# EasyEDA Pro project esp32_sd.eprj

# Schematic Schematic1
Board Name: Board1; Create Date: 2025-02-09; Page Name: P1; Project Name: esp32_sd; Schematic Name: Schematic1; Update Date: 2025-02-19; Company: 嘉立创EDA; Page Size: A4; Version: V1.0
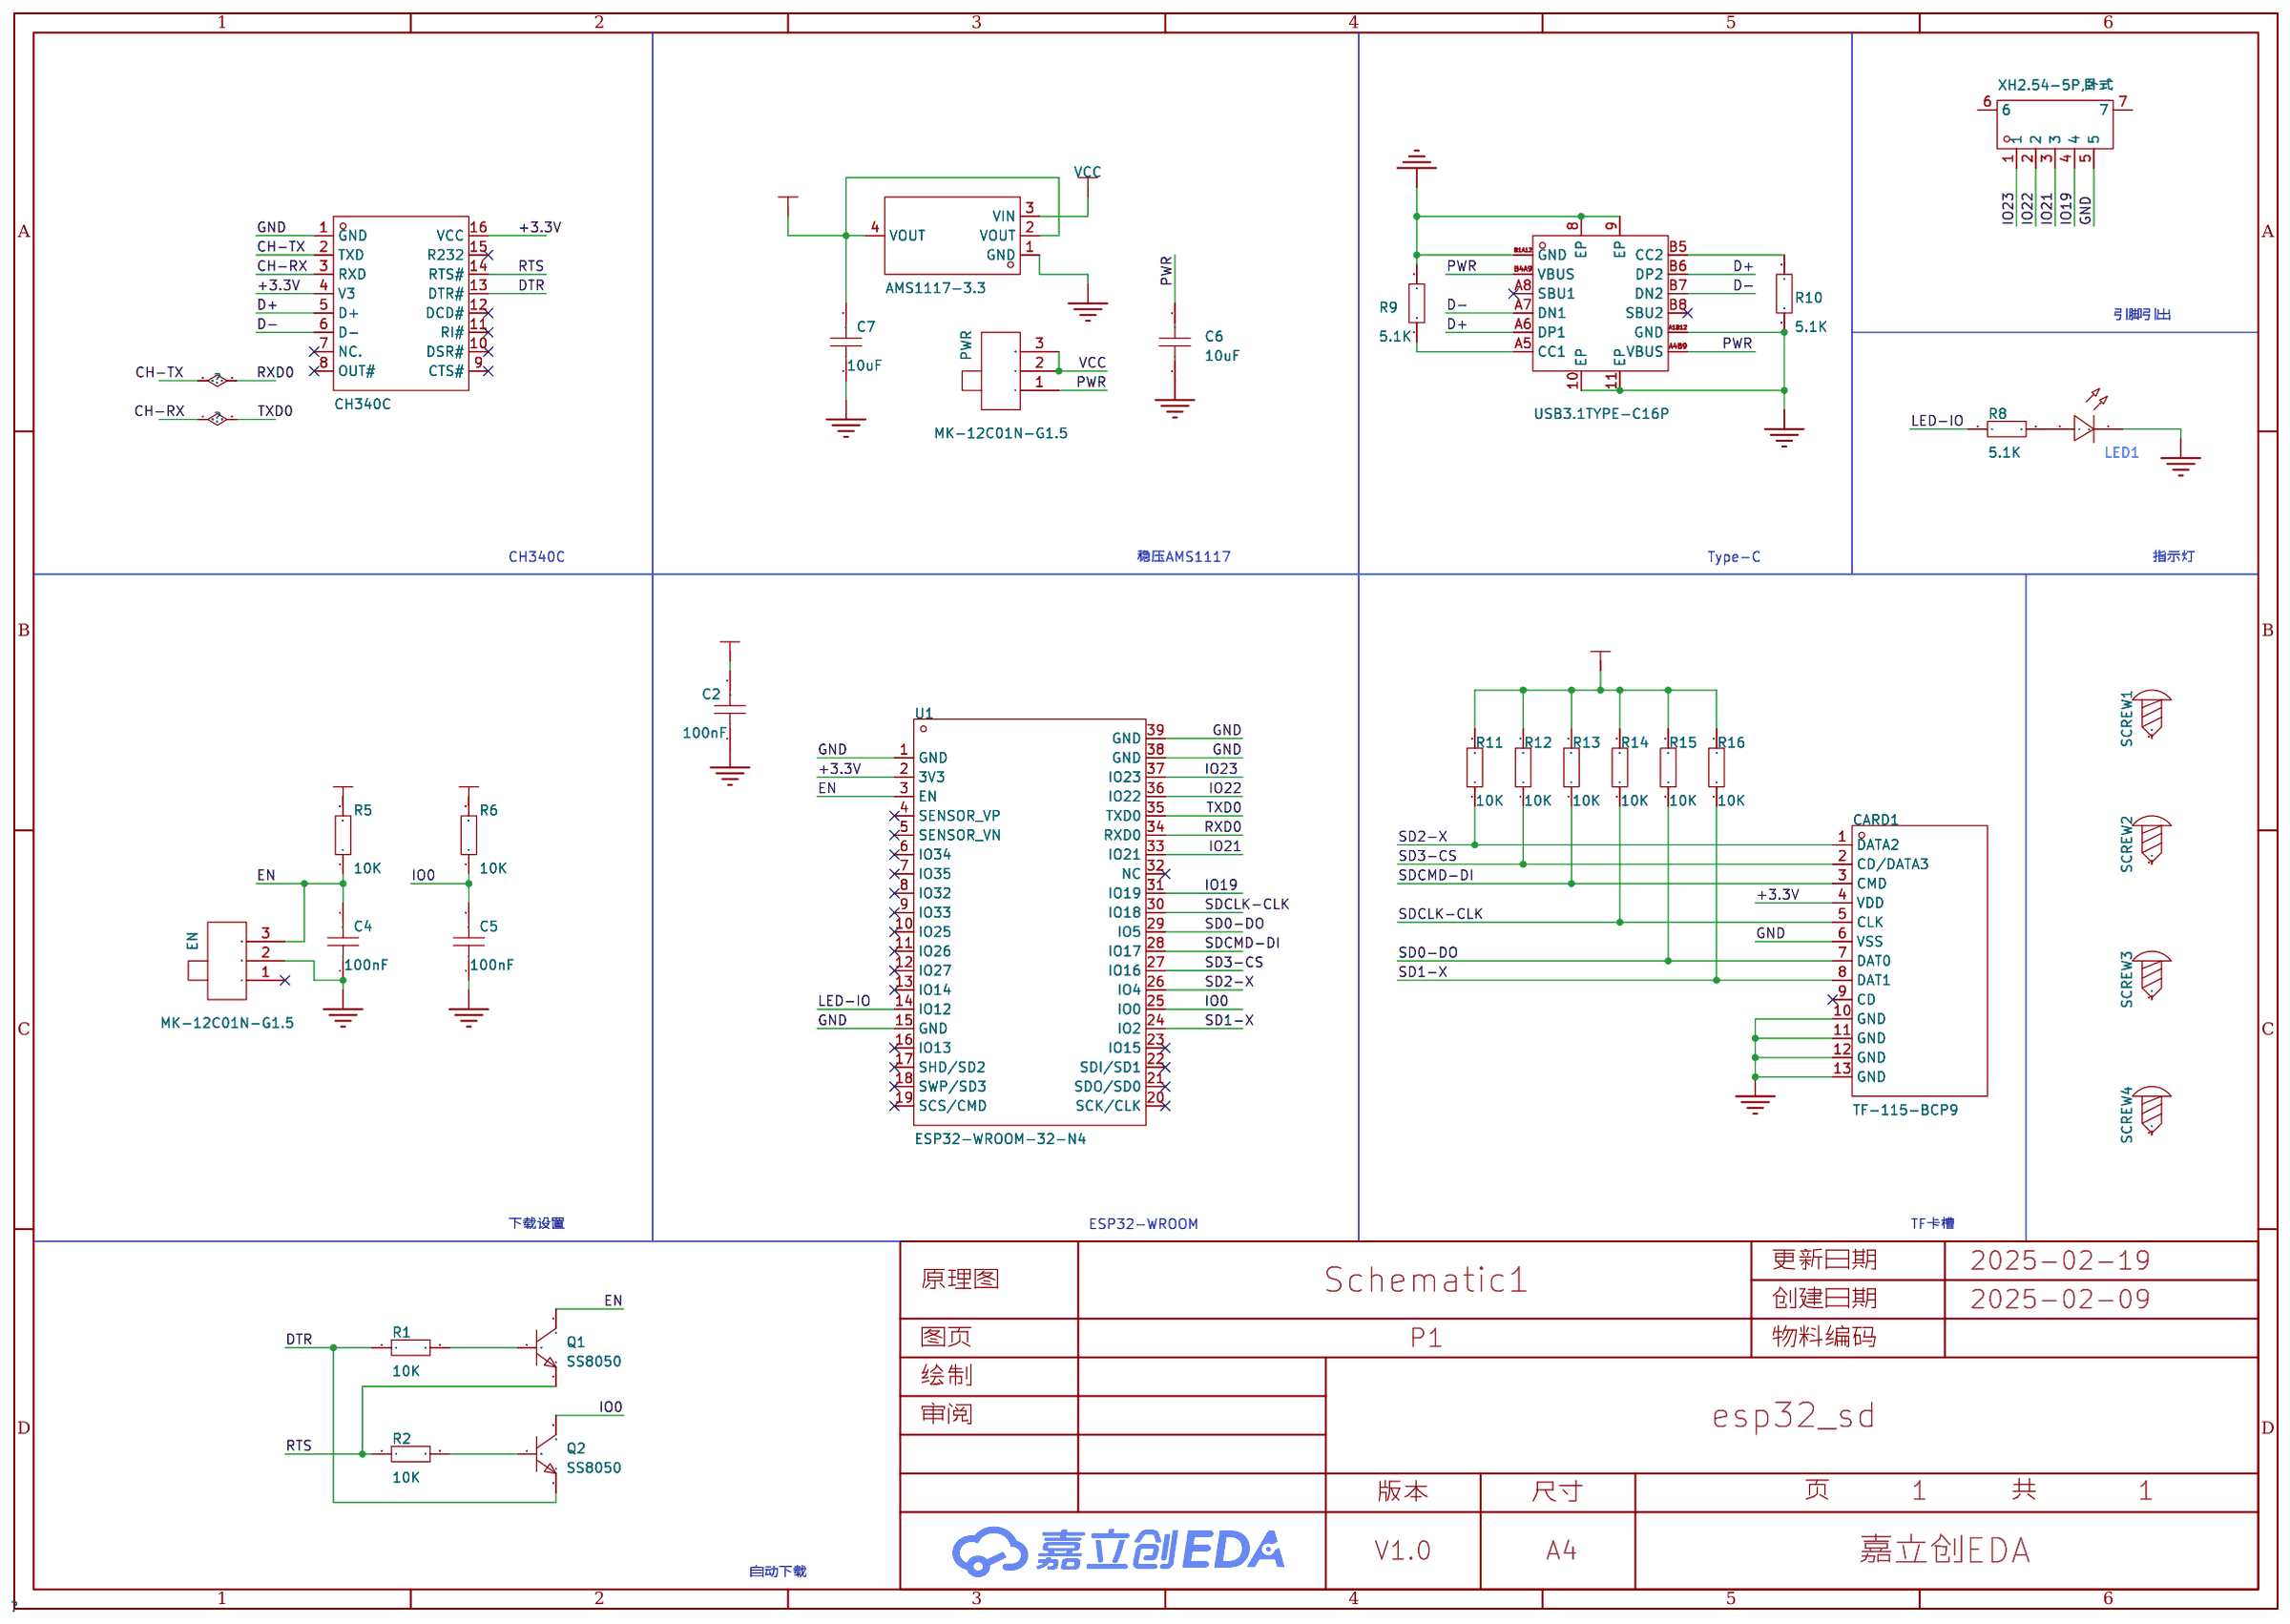
[diagram p0: schematic sheet]

## Parts
C2  100nF  [C0805]
C4  100nF  [C0805]
C5  100nF  [C0805]
C6  10uF  [C0805]
C7  10uF  [C0805]
CARD1  TF-115-BCP9  [TF-SMD_TF-115-BCP9]
EN  MK-12C01N-G1.5  [SW-SMD_DEALON_MK-12C01N-G1.5]
LED1  -  [LED_0805]
PWR  MK-12C01N-G1.5  [SW-SMD_DEALON_MK-12C01N-G1.5]
Q1  SS8050  [SOT-23-3_L2.9-W1.3-P1.90-LS2.4-BR]
Q2  SS8050  [SOT-23-3_L2.9-W1.3-P1.90-LS2.4-BR]
R1  10K  [R0805]
R2  10K  [R0805]
R5  10K  [R0805]
R6  10K  [R0805]
R8  5.1K  [R0805]
R9  5.1K  [R0805]
R10  5.1K  [R0805]
R11  10K  [R0805]
R12  10K  [R0805]
R13  10K  [R0805]
R14  10K  [R0805]
R15  10K  [R0805]
R16  10K  [R0805]
SCREW1  -  [M3螺丝]
SCREW2  -  [M3螺丝]
SCREW3  -  [M3螺丝]
SCREW4  -  [M3螺丝]
U1  ESP32-WROOM-32-N4  [WIFIM-SMD_ESP32-WROOM-32-N4]
U2  CH340C  [SOP-16_L10.0-W3.9-P1.27-LS6.0-BL]
U3  AMS1117-3.3  [SOT-223-3_L6.5-W3.4-P2.30-LS7.0-BR]
U5  XH2.54-5P,卧式  [CONN-SMD_5P-P2.50_XUNPU_WAFER-254W-5P]
USB3  USB3.1TYPE-C16P  [USB-C-SMD_TYPE-C-16PIN]

## Library data of the parts
C2 C4-C7 = CAP_0805: Supplier Footprint: 0805
CARD1 = TF-115-BCP9: LCSC Part Name: 自弹式 MicroSD卡(TF卡) 卡座; Supplier Part: C720505; Manufacturer: XUNPU(讯普); Supplier Footprint: SMD; JLCPCB Part Class: 扩展库; Datasheet: https://atta.szlcsc.com/upload/public/pdf/source/20210906/DBEC8F03AA1503572333C7CF4A76D0AD.pdf; Supplier: LCSC; Card Connection Mode: 自弹式; Card Type: MicroSD卡(TF卡); Connector Type: 卡座; Maximum Body Height: 1.8mm; Operating Temperature Range: -25℃~+85℃
EN PWR = MK-12C01N-G1.5: LCSC Part Name: 微型拨动开关; Supplier Part: C2904923; Manufacturer: DEALON(德艺隆); Supplier Footprint: SMD; JLCPCB Part Class: 扩展库; Datasheet: https://atta.szlcsc.com/upload/public/pdf/source/20211116/DB0E76B2A5CCB6919F2C3E33154185CD.pdf; Supplier: LCSC; Circuit: 单刀双掷; Actuator Style: 矩形柱状; Pin Style: 鸥翼型; Switch Length: 7mm; Switch Width: 1.5mm; Switch Height: 4.5mm; Mounting Style: 卧贴; Actuator Color: 黑色
LED1 = LED_0805-B: Supplier Footprint: 0805
Q1 Q2 = SS8050: LCSC Part Name: NPN 25V 1.5A 120-400 SOT-23; Supplier Part: C2931717; Manufacturer: Doeshare(德芯); Supplier Footprint: SOT-23; JLCPCB Part Class: 扩展库; Datasheet: https://atta.szlcsc.com/upload/public/pdf/source/20220106/99F9A3DFCBDD91265C711555CE6390BF.pdf; Supplier: LCSC
R1 R2 R5 R6 R8-R16 = Res_0805: Supplier Footprint: 0805
SCREW1-SCREW4 = M3螺丝: Supplier Footprint: 插件
U1 = ESP32-WROOM-32-N4: LCSC Part Name: WiFi+蓝牙4.2+双核CPU模块; Supplier Part: C82899; Manufacturer: ESPRESSIF(乐鑫); Supplier Footprint: SMD,18x25.5mm; JLCPCB Part Class: 扩展库; Datasheet: https://atta.szlcsc.com/upload/public/pdf/source/20210719/C82899_2D52724B6FAFABC419BCF308C5944296.pdf; Supplier: LCSC
U2 = CH340C: LCSC Part Name: CH340C USB转串口芯片 CH340; Supplier Part: C84681; Manufacturer: WCH(南京沁恒); Supplier Footprint: SOP-16; JLCPCB Part Class: 扩展库; Datasheet: https://atta.szlcsc.com/upload/public/pdf/source/20240619/63986D8440D4E5267A77ACD891CC4DE3.pdf; Supplier: LCSC; Applications Function: 收发器; Protocol: USB 2.0; Supply Voltage: 3.3V；5V; Data Rate: 2Mbps
U3 = AMS1117-3.3_C6186: LCSC Part Name: 输出3.3V 1A; Supplier Part: C6186; Manufacturer: AMS; Supplier Footprint: SOT-223; JLCPCB Part Class: 基础库; Datasheet: https://atta.szlcsc.com/upload/public/pdf/source/20180727/C6186_7A095716F0823C02F1997A905E26C086.pdf; Supplier: LCSC; Output Type: 固定; Output Voltage: 3.3V; MAX Output Current: 1A; Power Supply Rejection Ratio (PSRR): 72dB@(120Hz); Dropout Voltage: 1.3V@(800mA); Output Polarity: 正极; Number of Outputs: 1
U5 = XH2.54-5P,卧式: Supplier Part: C9900019986; Supplier Footprint: CONN-SMD_5P-P2.50; JLCPCB Part Class: 扩展库; Supplier: LCSC
USB3 = USB3.1TYPE-C16P: Supplier Part: C9900012665; Supplier Footprint: USB3.1_TYPE-C_16P; JLCPCB Part Class: 扩展库; Supplier: LCSC

## Nets
+3.3V: C2.2 C7.2 CARD1.4(VDD) R5.2 R6.2 R11.2 R12.2 R13.2 R14.2 R15.2 R16.2 U1.2(3V3) U2.4(V3) U2.16(VCC) U3.2(VOUT) U3.4(VOUT)
GND: C2.1 C4.1 C5.1 C6.1 C7.1 CARD1.6(VSS) CARD1.10(GND) CARD1.11(GND) CARD1.12(GND) CARD1.13(GND) EN.2 LED1.1(C) R9.2 R10.1 U1.1(GND) U1.15(GND) U1.38(GND) U1.39(GND) U2.1(GND) U3.1(GND) U5.5 USB3.8(EP) USB3.9(EP) USB3.10(EP) USB3.11(EP) USB3.A1B12(GND) USB3.B1A12(GND)
VCC: PWR.2 PWR.3 U3.3(VIN)
CH-RX: U1.35(TXD0) U2.3(RXD)
CH-TX: U1.34(RXD0) U2.2(TXD)
D+: U2.5(D+) USB3.A6(DP1) USB3.B6(DP2)
D-: U2.6(D-) USB3.A7(DN1) USB3.B7(DN2)
DTR: Q2.2(E) R1.1 U2.13(DTR#)
EN: C4.2 EN.3 Q1.3(C) R5.1 U1.3(EN)
IO0: C5.2 Q2.3(C) R6.1 U1.25(IO0)
IO19: U1.31(IO19) U5.4
IO21: U1.33(IO21) U5.3
IO22: U1.36(IO22) U5.2
IO23: U1.37(IO23) U5.1
LED-IO: R8.1 U1.14(IO12)
PWR: C6.2 PWR.1 USB3.A4B9(VBUS) USB3.B4A9(VBUS)
RTS: Q1.2(E) R2.1 U2.14(RTS#)
SD0-DO: CARD1.7(DAT0) R15.1 U1.29(IO5)
SD1-X: CARD1.8(DAT1) R16.1 U1.24(IO2)
SD2-X: CARD1.1(DATA2) R11.1 U1.26(IO4)
SD3-CS: CARD1.2(CD/DATA3) R12.1 U1.27(IO16)
SDCLK-CLK: CARD1.5(CLK) R14.1 U1.30(IO18)
SDCMD-DI: CARD1.3(CMD) R13.1 U1.28(IO17)
$1N614: Q1.1(B) R1.2
$1N618: Q2.1(B) R2.2
$1N4391: LED1.2(A) R8.2
$1N5041: R9.1 USB3.A5(CC1)
$1N5131: R10.2 USB3.B5(CC2)

Not connected (* = marked no-connect by the designer): CARD1 9(CD)*; EN 1*; SCREW1 1; SCREW2 1; SCREW3 1; SCREW4 1; U1 4(SENSOR_VP)* 5(SENSOR_VN)* 6(IO34)* 7(IO35)* 8(IO32)* 9(IO33)* 10(IO25)* 11(IO26)* 12(IO27)* 13(IO14)* 16(IO13)* 17(SHD/SD2)* 18(SWP/SD3)* 19(SCS/CMD)* 20(SCK/CLK)* 21(SDO/SD0)* 22(SDI/SD1)* 23(IO15)* 32(NC)*; U2 7(NC.)* 8(OUT#)* 9(CTS#)* 10(DSR#)* 11(RI#)* 12(DCD#)* 15(R232)*; U5 6 7; USB3 A8(SBU1)* B8(SBU2)*

## Notes on the sheet
- 引脚引出
- CH340C
- 稳压AMS1117
- Type-C
- 指示灯
- 下载设置
- ESP32-WROOM
- TF卡槽
- 自动下载

# Board PCB1
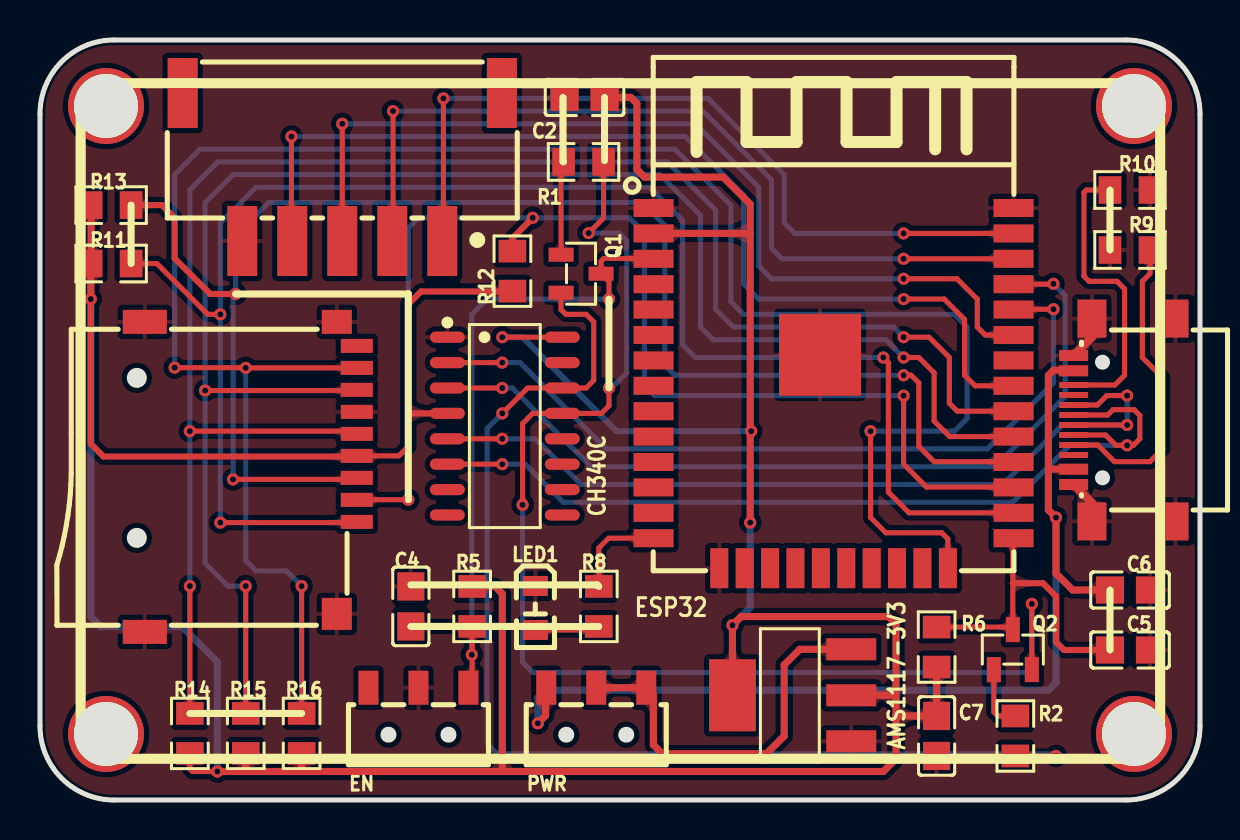
[diagram p1: board, top side]
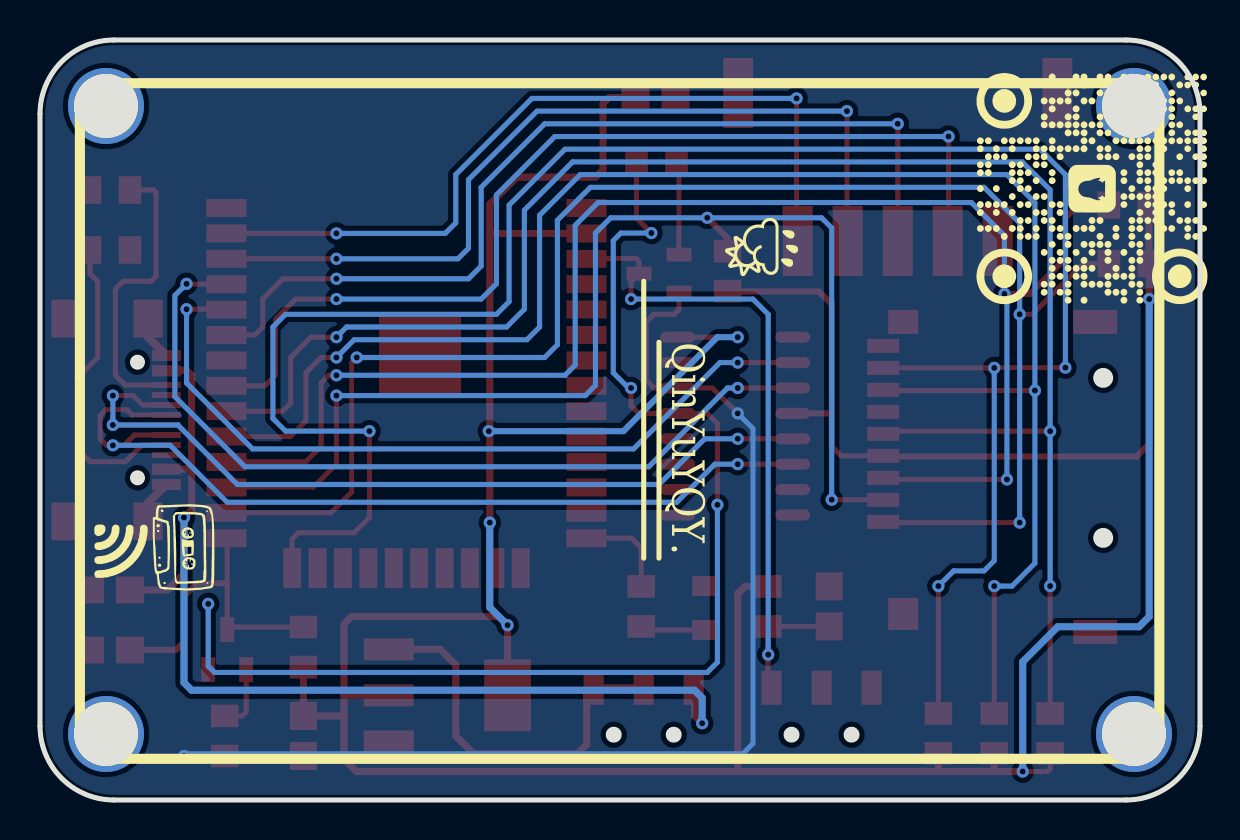
[diagram p2: board, bottom side, seen from below]

Outline 58 x 38 mm; copper layers: Top Layer, Bottom Layer. Coordinates in mm from the lower left corner of the outline.
Outline path: 0,34.3 0,3.7 arc(1.08,1.08) 3.7,0 54.3,0 arc(56.92,1.08) 58,3.7 58,34.3 arc(56.92,36.92) 54.3,38 3.7,38 arc(1.08,36.92) 0,34.3
Stack: Top Layer 0.035mm / Dielectric1 1.51mm FR4 er 4.5 / Bottom Layer 0.035mm

## Design rules (mm)
template: 自定义配置
spacing copperThickness1oz (default): track to track 0.102, other pairs 0.127 to 0.3
spacing copperThickness2oz: track to track 0.203, other pairs 0.152 to 0.3
track width copperThickness1oz (default): min 0.127, default 0.254, max 2.54
track width copperThickness2oz: min 0.203, default 0.254, max 2.54
differential pair differentialPair (default): width min 0.127, default 0.254, max 2.54; gap min 0.152, default 0.152
via viaSize (default): diameter min 0.5, default 0.61, max 10; hole min 0.3, default 0.305, max 6.299

## Placement (name value [footprint] x y rotation side)
C2  100nF  [C0805]  27.23 35.13 0 top
C4  100nF  [C0805]  18.54 9.68 270 top
C5  100nF  [C0805]  54.5 7.5 180 top
C6  10uF  [C0805]  54.5 10.5 180 top
C7  10uF  [C0805]  44.83 3.2 90 top
CARD1  TF-115-BCP9  [TF-SMD_TF-115-BCP9]  10.54 16.16 270 top
EN  MK-12C01N-G1.5  [SW-SMD_DEALON_MK-12C01N-G1.5]  18.92 5.61 0 top
LED1  -  [LED_0805]  24.76 9.55 270 top
PWR  MK-12C01N-G1.5  [SW-SMD_DEALON_MK-12C01N-G1.5]  27.81 5.61 0 top
Q1  SS8050  [SOT-23-3_L2.9-W1.3-P1.90-LS2.4-BR]  27.05 26.32 180 top
Q2  SS8050  [SOT-23-3_L2.9-W1.3-P1.90-LS2.4-BR]  48.64 7.52 270 top
R1  10K  [R0805]  27.18 31.9 180 top
R2  10K  [R0805]  48.77 3.2 90 top
R5  10K  [R0805]  21.61 9.68 90 top
R6  10K  [R0805]  44.83 7.65 270 top
R8  5.1K  [R0805]  27.94 9.68 270 top
R9  5.1K  [R0805]  54.5 27.5 180 top
R10  5.1K  [R0805]  54.5 30.5 180 top
R11  10K  [R0805]  3.56 26.82 180 top
R12  10K  [R0805]  23.62 26.44 270 top
R13  10K  [R0805]  3.56 29.75 180 top
R14  10K  [R0805]  7.49 3.33 270 top
R15  10K  [R0805]  10.29 3.33 270 top
R16  10K  [R0805]  13.08 3.33 270 top
SCREW1  -  [M3螺丝]  3.3 34.7 0 top
SCREW2  -  [M3螺丝]  54.7 34.7 0 top
SCREW3  -  [M3螺丝]  3.3 3.3 0 top
SCREW4  -  [M3螺丝]  54.7 3.3 90 top
U1  ESP32-WROOM-32-N4  [WIFIM-SMD_ESP32-WROOM-32-N4]  39.68 20.59 0 top
U2  CH340C  [SOP-16_L10.0-W3.9-P1.27-LS6.0-BL]  23.24 18.7 270 top
U3  AMS1117-3.3  [SOT-223-3_L6.5-W3.4-P2.30-LS7.0-BR]  37.59 5.23 0 top
U5  XH2.54-5P,卧式  [CONN-SMD_5P-P2.50_XUNPU_WAFER-254W-5P]  15.11 31.65 180 top
USB3  USB3.1TYPE-C16P  [USB-C-SMD_TYPE-C-16PIN]  54.23 19 90 top

## Footprints (pads in the part's own frame, mm; a bottom-side part is the same pattern mirrored in y, then rotated)
C0805
  rect 1.41x1.35 smd: 1(-1,0) 2(1,0)
CONN-SMD_5P-P2.50_XUNPU_WAFER-254W-5P
  rect 1.5x3.5 smd: 1(-5,3.7) 2(-2.5,3.7) 3(0,3.7) 4(2.5,3.7) 5(5,3.7) 6(-7.98,-3.7) 7(7.98,-3.7)
LED_0805
  rect 1x1.25 smd: 1(-1.15,0.005) 2(1.05,0.005)
M3螺丝
  round 3.8 hole 3.2: 1(0,0)
R0805
  rect 1.133x1.377 smd: 1(-1,0) 2(1,0)
SOP-16_L10.0-W3.9-P1.27-LS6.0-BL
  oval 0.56x1.745 smd: 1(-4.445,-2.873) 2(-3.175,-2.873) 3(-1.905,-2.873) 4(-0.635,-2.873) 5(0.635,-2.873) 6(1.905,-2.873) 7(3.175,-2.873) 8(4.445,-2.873) 9(4.445,2.873) 10(3.175,2.873) 11(1.905,2.873) 12(0.635,2.873) 13(-0.635,2.873) 14(-1.905,2.873) 15(-3.175,2.873) 16(-4.445,2.873)
SOT-23-3_L2.9-W1.3-P1.90-LS2.4-BR
  rect 1.25x0.7 smd: 1(1,-0.95) 2(1,0.95) 3(-1,0)
SOT-223-3_L6.5-W3.4-P2.30-LS7.0-BR
  rect 2.5x1.1 smd: 1(2.97,-2.3) 2(2.97,0) 3(2.97,2.3)
  rect 2.34x3.6 smd: 4(-2.97,0)
SW-SMD_DEALON_MK-12C01N-G1.5
  rect 1x1.7 smd: 1(-2.5,0) 2(0,0) 3(2.5,0)
TF-SMD_TF-115-BCP9
  rect 0.7x1.6 smd: 1(2.25,5.3) 2(1.15,5.3) 3(0.05,5.3) 4(-1.05,5.3) 5(-2.15,5.3) 6(-3.25,5.3) 7(-4.35,5.3) 8(-5.45,5.3) 9(-6.55,5.3)
  rect 1.2x1.5 smd: 10(-7.75,4.3)
  rect 1.2x2.2 smd: 11(-7.75,-5.3) 13(7.75,-5.3)
  rect 1.6x1.5 smd: 12(6.85,4.3)
USB-C-SMD_TYPE-C-16PIN
  rect 1.9x1.45 smd: 8(-5.07,1.633) 9(5.07,1.633)
  rect 1.9x1.3 smd: 10(-5.07,-2.547) 11(5.07,-2.547)
  rect 0.55x1.45 smd: A1B12(-3.225,2.547) A4B9(-2.46,2.547) B1A12(3.225,2.547) B4A9(2.46,2.547)
  rect 0.3x1.45 smd: A5(-1.25,2.547) A6(-0.25,2.547) A7(0.25,2.547) A8(1.25,2.547) B5(1.75,2.547) B6(0.75,2.547) B7(-0.75,2.547) B8(-1.75,2.547)
WIFIM-SMD_ESP32-WROOM-32-N4
  rect 2x0.9 smd: 1(-9,9.005) 2(-9,7.735) 3(-9,6.465) 4(-9,5.195) 5(-9,3.925) 6(-9,2.655) 7(-9,1.385) 8(-9,0.115) 9(-9,-1.155) 10(-9,-2.425) 11(-9,-3.695) 12(-9,-4.965) 13(-9,-6.235) 14(-9,-7.505) 25(9,-7.505) 26(9,-6.235) 27(9,-4.965) 28(9,-3.695) 29(9,-2.425) 30(9,-1.155) 31(9,0.115) 32(9,1.385) 33(9,2.655) 34(9,3.925) 35(9,5.195) 36(9,6.465) 37(9,7.735) 38(9,9.005)
  rect 0.9x2 smd: 15(-5.715,-9.005) 16(-4.445,-9.005) 17(-3.175,-9.005) 18(-1.905,-9.005) 19(-0.635,-9.005) 20(0.635,-9.005) 21(1.905,-9.005) 22(3.175,-9.005) 23(4.445,-9.005) 24(5.715,-9.005)
  rect 4.1x4.1 smd: 39(-0.68,1.665)

## Nets
As in the schematic.

Pads without a net: CARD1 9; EN 1; SCREW1 1; SCREW2 1; SCREW3 1; SCREW4 1; U1 4 5 6 7 8 9 10 11 12 13 16 17 18 19 20 21 22 23 32; U2 7 8 9 10 11 12 15; U5 6 7; USB3 A8 B8

## Via types
v1: diameter 0.61, hole 0.305, Top Layer to Bottom Layer, 52 vias

## Routing (per net, layer and track width the routed paths; a pad name or vN(x,y) marks a point on that pad's centre or on a via; arc(x,y) is an arc through that point)
+3.3V: length 200.8
  Top Layer w0.254: 18.41,17.68 17.94,17.21 CARD1.4 ; U2.16 v1(23.11,23.14) ; R14.2 7.49,1.55 7.62,1.42 v1(8.86,1.42)
  Top Layer w0.305: U2.4 18.42,19.33 ; 18.41,19.33 18.41,17.68 ; 18.41,19.33 18.41,24.79 19.05,25.43 23.61,25.43 R12.2 ; v1(2.54,25.05) 2.54,17.81 3.17,17.17 15.81,17.17 CARD1.4
  Top Layer w0.355: 42.8,4.22 42.8,2.06 42.16,1.42 23.12,1.42 ; 42.8,4.22 42.8,5.25 ; 42.8,4.22 42.82,4.2 C7.2 R6.2 ; U3.4 v1(34.62,8.74) 35.05,9.17 42.42,9.17 42.8,8.79 42.8,5.25 ; 13.14,1.42 10.29,1.42 ; 13.14,1.42 13.08,1.48 R16.2 ; 13.14,1.42 23.12,1.42 ; 10.29,1.42 v1(8.86,1.42) ; 10.29,1.42 R15.2 ; 23.12,1.42 23.11,1.43 23.11,10.31 22.75,10.68 R5.2 ; C2.2 29.54,35.13 29.84,34.83 29.84,31.52 30.23,31.14 34.16,31.14 35.51,29.79 35.51,28.34 ; 42.8,5.25 42.79,5.23 U3.2 ; R13.2 R11.2 2.54,26.81 v1(2.54,25.05) ; 35.51,28.34 35.5,28.33 U1.2 ; 35.51,28.34 v1(35.51,13.87)
  Bottom Layer w0.305: v1(35.56,18.44) 28.83,18.44 24.13,23.14 v1(23.11,23.14)
  Bottom Layer w0.355: v1(34.62,8.74) 35.51,9.63 v1(35.51,13.87) ; v1(8.86,1.42) 8.86,6.91 7.11,8.66 3.05,8.66 2.54,9.17 v1(2.54,25.05)
GND: length 4.4
  Top Layer w0.406: USB3.B1A12 52.6,23.14 USB3.9 ; USB3.8 52.6,14.86 USB3.A1B12
VCC: length 19.8
  Top Layer w0.355: PWR.2 PWR.3 30.67,5.26 30.67,2.76 31.12,2.31 36.32,2.31 37.21,3.2 37.21,6.76 37.99,7.53 U3.3
CH-RX: length 41.9
  Top Layer w0.254: v1(50.67,25.81) 50.66,25.79 U1.35 ; U2.3 v1(23.11,20.6)
  Bottom Layer w0.254: v1(50.67,25.81) 51.26,25.22 51.26,20.17 47.75,16.66 27.56,16.66 23.62,20.6 v1(23.11,20.6)
CH-TX: length 39.1
  Top Layer w0.254: U2.2 v1(23.11,21.87) ; v1(50.67,24.54) 48.7,24.54 U1.34
  Bottom Layer w0.254: v1(50.67,24.54) 50.67,20.86 47.37,17.55 28.32,17.55 24,21.87 v1(23.11,21.87)
D+: length 43.2
  Top Layer w0.254: v1(54.36,18.75) USB3.A6 ; v1(54.36,20.22) 53.34,20.22 52.87,19.75 USB3.B6 ; v1(23.11,18.06) U2.5
  Bottom Layer w0.254: 54.23,18.75 54.36,18.88 v1(54.36,20.22) ; 54.23,18.75 51.11,18.75 48.13,15.78 27.05,15.78 24.76,18.06 v1(23.11,18.06) ; 54.23,18.75 v1(54.36,18.75)
D-: length 44.3
  Top Layer w0.254: v1(23.11,16.79) U2.6 ; USB3.B7 53.28,18.25 53.79,17.73 v1(54.36,17.73) 54.66,17.73 54.99,18.06 54.99,19.23 54.7,19.52 53.65,19.52 53.39,19.25 USB3.A7
  Bottom Layer w0.254: v1(23.11,16.79) 24.26,16.79 26.16,14.89 48.64,14.89 51.49,17.73 v1(54.36,17.73)
DTR: length 63.4
  Top Layer w0.254: R1.1 28.18,29.09 v1(27.43,28.35) ; 49.59,6.52 v1(49.59,9.81) ; 28.57,20.6 28.45,20.47 28.45,19.71 28.07,19.33 U2.13 24.64,19.33 24.13,18.82 v1(24.13,14.76)
  Bottom Layer w0.254: v1(24.13,14.76) 24.13,6.89 24.64,6.38 49.28,6.38 49.59,6.69 v1(49.59,9.81) ; v1(27.43,28.35) 28.96,28.35 29.34,27.97 29.34,21.36 28.57,20.6
  vias: v1(28.45,20.6)
EN: length 35.2
  Top Layer w0.254: 21.61,7.23 21.59,7.25 v1(21.59,7.27) ; 21.61,7.23 21.61,5.8 EN.3 ; 21.61,7.23 R5.1 C4.2 ; v1(28.45,25.05) 28.45,25.92 Q1.3 28.05,26.94 28.19,27.08 30.66,27.08 U1.3
  Bottom Layer w0.254: v1(21.59,7.27) 21.59,24.28 22.35,25.05 v1(28.45,25.05)
IO0: length 16
  Top Layer w0.254: U1.25 48.64,13.05 Q2.3 48.51,8.65 R6.1
  Top Layer w0.305: C5.2 51.2,7.5 50.8,7.9 50.8,10.19 50.15,10.84 48.64,10.84
IO19: length 50.7
  Top Layer w0.254: v1(43.18,25.05) 45.21,25.05 46.23,24.03 46.23,21.24 46.75,20.71 U1.31 ; U5.4 12.57,27.99 v1(12.57,33.17)
  Bottom Layer w0.254: v1(12.57,33.17) 32.26,33.17 35.18,30.25 35.18,25.81 35.94,25.05 v1(43.18,25.05)
IO21: length 46.9
  Top Layer w0.254: v1(43.18,26.06) 45.85,26.06 46.86,25.05 46.86,23.65 47.26,23.25 U1.33 ; U5.3 v1(15.11,33.81)
  Bottom Layer w0.254: v1(15.11,33.81) 32.77,33.81 35.94,30.63 35.94,26.7 36.58,26.06 v1(43.18,26.06)
IO22: length 42.6
  Top Layer w0.254: U1.36 v1(43.18,27.06) ; U5.2 17.65,27.99 v1(17.65,34.44)
  Bottom Layer w0.254: v1(43.18,27.06) 37.1,27.06 36.58,27.59 36.58,31.02 33.15,34.44 v1(17.65,34.44)
IO23: length 39.9
  Top Layer w0.254: U5.1 20.17,28.01 v1(20.17,35.08) ; U1.37 v1(43.18,28.33)
  Bottom Layer w0.254: v1(20.17,35.08) 33.4,35.08 37.21,31.27 37.21,28.86 37.74,28.33 v1(43.18,28.33)
LED-IO: length 4.9
  Top Layer w0.254: U1.14 28.43,13.09 27.94,12.6 R8.1
PWR: length 53.4
  Top Layer w0.355: USB3.B4A9 51.65,21.49 50.67,21.49 50.42,21.24 50.42,14.5 v1(50.8,14.12) 50.8,11.33 51.63,10.5 C6.2 ; USB3.A4B9 50.42,16.54 ; v1(24.89,3.84) 25.27,4.22 25.27,5.58 PWR.1
  Bottom Layer w0.355: v1(24.89,3.84) 24.89,5.11 25.27,5.49 50.42,5.49 50.8,5.87 v1(50.8,14.12)
RTS: length 58.5
  Top Layer w0.254: R2.1 v1(50.8,2.2) ; v1(23.11,19.33) 24.38,20.6 U2.14 27.31,20.6 27.69,20.98 27.69,23.9 27.31,24.28 26.29,24.28 26.05,24.52 Q1.2
  Bottom Layer w0.254: v1(23.11,19.33) 22.35,18.57 22.35,2.82 22.86,2.31 50.69,2.31 v1(50.8,2.2)
SD0-DO: length 85.6
  Top Layer w0.254: v1(8.25,20.47) 15.81,20.47 CARD1.7 ; U1.29 45.48,18.17 44.7,18.95 44.7,21.36 43.94,22.12 v1(43.18,22.12) ; R15.1 v1(10.29,10.69)
  Bottom Layer w0.254: v1(10.29,10.69) 9.4,10.69 8.25,11.84 v1(8.25,20.47) 8.25,29.87 9.65,31.27 30.99,31.27 33.02,29.24 33.02,23.65 33.66,23.01 42.29,23.01 v1(43.18,22.12)
SD1-X: length 104.4
  Top Layer w0.254: U1.24 45.39,13.05 45.09,13.36 42.29,13.36 41.53,14.12 41.53,18.31 ; v1(6.73,21.62) 10.28,21.62 v1(10.29,21.61) CARD1.8 ; R16.1 v1(13.08,10.69)
  Bottom Layer w0.254: 41.53,18.31 41.66,18.44 45.72,18.44 46.35,19.08 46.35,23.65 45.72,24.28 35.18,24.28 34.54,24.92 34.54,29.75 31.75,32.54 8,32.54 6.73,31.27 v1(6.73,21.62) ; v1(10.29,21.61) 10.29,11.97 10.79,11.46 12.32,11.46 v1(13.08,10.69)
  vias: v1(41.53,18.44)
SD2-X: length 81.9
  Top Layer w0.254: v1(9.02,13.87) 15.81,13.87 CARD1.1 ; v1(9.02,24.28) 8.38,24.28 5.84,26.82 R11.1 ; U1.26 43.45,14.36 42.42,15.39 42.42,21.87 v1(42.16,22.12)
  Bottom Layer w0.254: v1(42.16,22.12) 32.77,22.12 32.13,22.76 32.13,28.98 30.48,30.63 10.79,30.63 9.02,28.86 v1(9.02,24.28) v1(9.02,13.87)
SD3-CS: length 60.8
  Top Layer w0.254: CARD1.2 15.85,15.01 v1(18.41,15.01) ; U1.27 48.66,15.65 44.32,15.65 43.18,16.79 v1(43.18,20.22)
  Top Layer w0.305: R12.1 23.62,28.09 v1(24.64,29.11)
  Bottom Layer w0.254: v1(18.41,15.01) 18.41,28.6 18.92,29.11 v1(24.64,29.11) 29.46,29.11 30.23,28.35 30.23,20.73 30.73,20.22 v1(43.18,20.22)
SDCLK-CLK: length 85.7
  Top Layer w0.254: CARD1.5 15.71,18.44 v1(7.49,18.44) ; v1(43.18,23.14) 44.45,23.14 45.47,22.12 45.47,19.84 45.87,19.44 U1.30 ; R14.1 v1(7.49,10.69)
  Bottom Layer w0.254: v1(7.49,10.69) v1(7.49,18.44) 7.49,30.51 8.89,31.9 31.37,31.9 33.78,29.49 33.78,24.54 34.67,23.65 42.67,23.65 v1(43.18,23.14)
SDCMD-DI: length 77.6
  Top Layer w0.254: v1(43.18,21.24) 43.56,21.24 43.94,20.86 43.94,17.68 44.7,16.92 48.66,16.92 U1.28 ; v1(9.65,16.03) 15.76,16.03 CARD1.3
  Top Layer w0.305: v1(9.78,25.3) 8.51,25.3 6.73,27.08 6.73,29.11 6.1,29.75 R13.1
  Bottom Layer w0.254: v1(43.18,21.24) 31.75,21.24 31.24,21.74 31.24,28.73 30.1,29.87 11.43,29.87 9.78,28.22 v1(9.78,25.3) 9.65,25.17 v1(9.65,16.03)
$1N614: length 4.7
  Top Layer w0.254: R1.2 26.05,31.78 Q1.1
$1N618: length 3.3
  Top Layer w0.254: Q2.1 47.69,4.41 47.9,4.2 R2.2
$1N4391: length 3.2
  Top Layer w0.254: LED1.2 27.76,8.5 R8.2
$1N5041: length 15.6
  Top Layer w0.254: R9.1 55.5,26.32 55.12,25.94 55.12,22.12 56.13,21.11 56.13,17.55 55.5,16.92 53.72,16.92 52.89,17.75 USB3.A5
$1N5131: length 14.9
  Top Layer w0.254: R10.2 52.32,30.5 52.2,30.38 52.2,26.19 52.45,25.94 53.85,25.94 54.23,25.55 54.23,21.24 53.74,20.75 USB3.B5

## Copper pours and planes (outline as drawn; the poured copper is in the pictures)
GND on Top Layer: 0,38 58.04,38 58.04,-0.1 0,-0.1
RTS on Bottom Layer: 0,38 58.04,38 58.04,-0.1 0,-0.1

Small or netless copper shapes (teardrops, artwork), in the pictures only: 164 on Top Layer, 58 on Bottom Layer

## Text on the board
Bottom Silkscreen Layer: QinYuYQY.
Top Silkscreen Layer: AMS1117-3V3 | CH340C | ESP32
